# Altium schematic sheet DM0255_Power.SchDoc: =project_title
size Tabloid; PageSetup: Record=PageOptions|CenterHorizontal=True|CenterVertical=True|PrintScale=0.73|XCorrection=1.00|YCorrection=1.00|PrintKind=0|BorderSize=5000000|LeftOffset=0|BottomOffset=0|Orientation=2|PaperLength=1000|PaperWidth=1000|Scale=100|PaperSource=7|PrintQuality=-4|MediaType=1|DitherType=10|PaperKind=A4|PrintScaleMode=1; CompanyName: Luxonis Holding; Organization: Luxonis Holding; Address1: 1925 Harmony Park Drive; Address2: Westminster, CO; Address3: 80234; Address4: United States; SheetNumber: 2; SheetTotal: 3
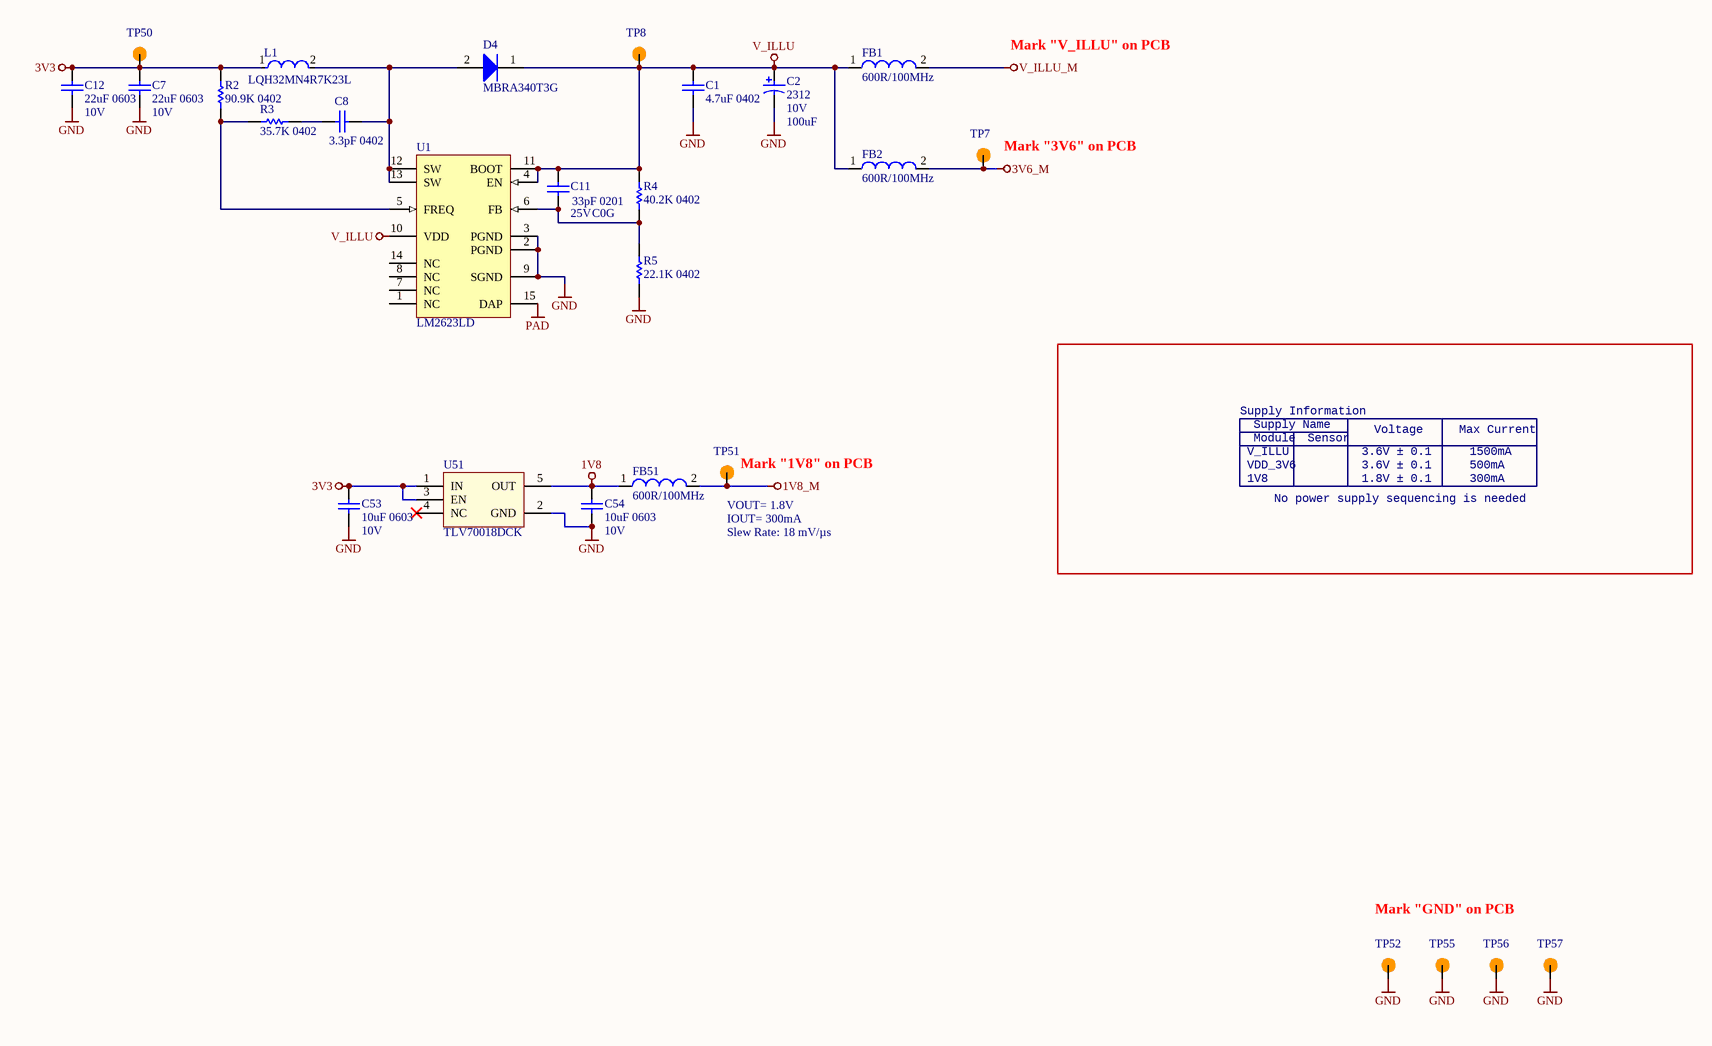
[diagram p0: DM0255_Power.SchDoc]

## Parts
C1  4.7uF 0402  [CAPC0402(1005)70_N]
C2  Size Code: 2312  Rated DC Voltage (URdc): 10V  Capacitance: 100uF  [AVX-TAJ-C-2_L]  (hidden comment: TAJC107K010RNJ)
C7  22uF 0603  Voltage Rating: 10V  [CAPC0603(1608)100_N]
C8  3.3pF 0402  [CAPC0402(1005)60_L]
C11  33pF 0201  Voltage Rating: 25V  Dielectric: C0G  [CAPC0201(0603)33_L]
C12  22uF 0603  Voltage Rating: 10V  [CAPC0603(1608)100_N]
C53  10uF 0603  Voltage Rating: 10V  [CAPC0603(1608)100_N]
C54  10uF 0603  Voltage Rating: 10V  [CAPC0603(1608)100_N]
D4  MBRA340T3G  [ONSC-SMA-2-403D-02_F_V]
FB1  600R/100MHz  [2508056017Y2]
FB2  600R/100MHz  [2508056017Y2]
FB51  600R/100MHz  [2508056017Y2]
L1  LQH32MN4R7K23L  [FP-LQH32CH_23-MFG]
R2  90.9K 0402  [RESC0402(1005)_L]
R3  35.7K 0402  [RESC0402(1005)_L]
R4  40.2K 0402  [RESC0402(1005)_L]
R5  22.1K 0402  [RESC0402(1005)_N]
TP7  TP100_150_NS  [TP100_150_NS]  (value not drawn)  (no BOM)
TP8  TP100_150_NS  [TP100_150_NS]  (value not drawn)  (no BOM)
TP50  TP100_150_NS  [TP100_150_NS]  (value not drawn)  (no BOM)
TP51  TP100_150_NS  [TP100_150_NS]  (value not drawn)  (no BOM)
TP52  TP100_150_NS  [TP100_150_NS]  (value not drawn)  (no BOM)
TP55  TP100_150_NS  [TP100_150_NS]  (value not drawn)  (no BOM)
TP56  TP100_150_NS  [TP100_150_NS]  (value not drawn)  (no BOM)
TP57  TP100_150_NS  [TP100_150_NS]  (value not drawn)  (no BOM)
U1  LM2623LD  [LDA14A]
U51  TLV70018DCK  [TLV70018DCK]

## Nets
1V8: C54.2 FB51.1 U51.5(OUT)
1V8_M: FB51.2 TP51.1
3V3: C7.2 C12.2 C53.2 L1.1 R2.2 TP50.1 U51.1(IN) U51.3(EN)
3V6_M: FB2.2 TP7.1
GND: C1.1 C2.2 C7.1 C12.1 C53.1 C54.1 R5.1 TP52.1 TP55.1 TP56.1 TP57.1 U1.2(PGND) U1.3(PGND) U1.9(SGND) U51.2(GND)
PAD: U1.15(DAP)
V_ILLU: C1.2 C2.1 C11.2 D4.1(K) FB1.1 FB2.1 R4.2 TP8.1 U1.4(EN) U1.10(VDD) U1.11(BOOT)
V_ILLU_M: FB1.2
NetC8_1: C8.1 R3.2
NetC8_2: C8.2 D4.2(A) L1.2 U1.12(SW) U1.13(SW)
NetC11_1: C11.1 R4.1 R5.2 U1.6(FB)
NetR2_1: R2.1 R3.1 U1.5(FREQ)

Not connected (* = marked no-connect by the designer): U1 1(NC) 7(NC) 8(NC) 14(NC); U51 4(NC)*

## Notes on the sheet
- Mark "V_ILLU" on PCB
- (near TP7) Mark "3V6" on PCB
- Supply Information
- Supply Name
- Voltage
- Max Current
- VOUT= 1.8V
- (near TP51) Mark "1V8" on PCB
- V_ILLU
- VDD_3V6
- 1V8
- Module
- No power supply sequencing is needed
- Sensor
- 3.6V ± 0.1
- 1.8V ± 0.1
- 1500mA
- 500mA
- 300mA
- IOUT= 300mA
- Slew Rate: 18 mV/µs
- Mark "GND" on PCB
- Title
- Size:
- Date:
- Tabloid
- Number:
- Time:
- Revision:
- Sheet
- of
- Drawn by:

## Library data of the parts
C1 = GRM155R60J475ME87D: CAP CER 4.7UF 6.3V X5R 0402; Manufacturer 1: Murata; Tolerance: 20%; Supplier 1: Digi-Key; Manufacturer Part Number 1: GRM155R60J475ME87D; RoHS: Yes; Category: Ceramic Capacitors; Stock 1: 207854; Pricing 1: 1=0,14000, 10=0,10100, 50=0,05720, 100=0,04740, 500=0,03322, 1000=0,02750, 2500=0,02559, 5000=0,02341 (USD); Mount: Surface Mount; Case/Package: 0402; Case Code (Metric): 1005; Case Code (Imperial): 0402; Min Operating Temperature: -55°C; Max Operating Temperature: 85°C; Capacitance: 4.7uF; Dielectric: X5R; Package Quantity: 1; Voltage Rating: 6.3V; Packaging: Tape and Reel; Voltage: 6.3V; Voltage Rating (DC): 6.3V; Series: GRM; Construction: Flat; Length: 1mm; Width: 0.02inch; Height: 0.5mm; Thickness: 0.022inch; Depth: 0.5mm; Radiation Hardening: No; REACH SVHC: No SVHC; Lead Free: Lead Free; RoHS Compliant: Yes; ComponentLink1URL: https://datasheet.ciiva.com/3779/21116grm155r60j475me8723-3779229.pdf?src-supplier=Arrow+Electronics; ComponentLink1Description: https://datasheet.ciiva.com/3779/21116grm155r60j475me8723-3779229.pdf?src-supplier=Arrow+Electronics; ComponentLink2URL: https://datasheet.ciiva.com/136/partnumbering-e-01-136783.pdf?src-supplier=Digi-Key; ComponentLink2Description: https://datasheet.ciiva.com/136/partnumbering-e-01-136783.pdf?src-supplier=Digi-Key; ComponentLink3URL: https://datasheet.ciiva.com/136/partnumbering-e-01-136784.pdf?src-supplier=Digi-Key; ComponentLink3Description: https://datasheet.ciiva.com/136/partnumbering-e-01-136784.pdf?src-supplier=Digi-Key; Supplier Part Number 1: 490-5408-1-ND
C2 = TAJC107K010RNJ: Tantalum Capacitor, Polarized, Tantalum (dry/solid), 10V, 10% +Tol, 10% -Tol, 100uF, Surface Mount, 2312; Manufacturer 1: Kyocera AVX; ESR (Equivalent Series Resistance): 1.2R; Leakage Current: 10uA; Tan Delta: 0.08; Reference Standard: CECC30801-005; Supplier 1: Digi-Key; Manufacturer Part Number 1: TAJC107K010RNJ; RoHS: Yes; Category: Tantalum Capacitors; Stock 1: 2500; Pricing 1: 1=0,67000, 10=0,47300, 50=0,35780, 100=0,31160 (USD); Mount: Surface Mount; Number of Pins: 2; Dielectric Material: Tantalum; Package Shape: Rectangular; Terminal Finish: Nickel; Min Operating Temperature: -55°C; Max Operating Temperature: 125°C; JESD-609 Code: e3; Polarity: Polarized; Capacitor Type: Tantalum; Negative Tolerance: 10%; Package Style: SMTMeter; Packaging: Tape and Reel; Positive Tolerance: 10%; Termination: J BEND; Length: 6mm; Width: 3.2mm; Height: 2.6mm; REACH SVHC: Yes; RoHS Compliant: Yes; ComponentLink1URL: https://datasheet.ciiva.com:443/pdfs/VipMasterIC/IC/AVXC/AVXC-S-A0008794508/AVXC-S-A0008794508-1.pdf?src-supplier=IHS+Markit; ComponentLink1Description: https://datasheet.ciiva.com:443/pdfs/VipMasterIC/IC/AVXC/AVXC-S-A0008794508/AVXC-S-A0008794508-1.pdf?src-supplier=IHS+Markit; ComponentLink2URL: https://datasheet.ciiva.com/6186/13070-6186737.pdf?src-supplier=Farnell; ComponentLink2Description: https://datasheet.ciiva.com/6186/13070-6186737.pdf?src-supplier=Farnell; ComponentLink3URL: https://datasheet.ciiva.com/11793/0900766b80ccdc61-11793710.pdf?src-supplier=RSComponents; ComponentLink3Description: https://datasheet.ciiva.com/11793/0900766b80ccdc61-11793710.pdf?src-supplier=RSComponents; ComponentLink4URL: https://datasheet.ciiva.com/26341/559445-da-01-en-tacc-c-6-0-mm-x-3-2-mm-x-2-6-mm-100-uf-26341786.pdf?src-supplier=Conrad; ComponentLink4Description: https://datasheet.ciiva.com/26341/559445-da-01-en-tacc-c-6-0-mm-x-3-2-mm-x-2-6-mm-100-uf-26341786.pdf?src-supplier=Conrad; ComponentLink5URL: https://datasheet.ciiva.com/7720/taj-7720616.pdf?src-supplier=Element14; ComponentLink5Description: https://datasheet.ciiva.com/7720/taj-7720616.pdf?src-supplier=Element14; ComponentLink6URL: https://datasheet.ciiva.com/14608/70001050-14608635.pdf?src-supplier=Allied+Electronics; ComponentLink6Description: https://datasheet.ciiva.com/14608/70001050-14608635.pdf?src-supplier=Allied+Electronics; ComponentLink7URL: https://datasheet.ciiva.com/7720/taj-7720618.pdf?src-supplier=Element14; ComponentLink7Description: https://datasheet.ciiva.com/7720/taj-7720618.pdf?src-supplier=Element14; ComponentLink8URL: https://datasheet.ciiva.com/18710/taj-eng-18710871.pdf?src-supplier=Distrelec; ComponentLink8Description: https://datasheet.ciiva.com/18710/taj-eng-18710871.pdf?src-supplier=Distrelec; ComponentLink9URL: https://datasheet.ciiva.com/3004/taj-3004482.pdf?src-supplier=Avnet; ComponentLink9Description: https://datasheet.ciiva.com/3004/taj-3004482.pdf?src-supplier=Avnet; ComponentLink10URL: https://datasheet.ciiva.com/16486/taj-16486014.pdf?src-supplier=Avnet+Asia; ComponentLink10Description: https://datasheet.ciiva.com/16486/taj-16486014.pdf?src-supplier=Avnet+Asia; ComponentLink11URL: https://datasheet.ciiva.com/264/taj-264316.pdf?src-supplier=Digi-Key; ComponentLink11Description: https://datasheet.ciiva.com/264/taj-264316.pdf?src-supplier=Digi-Key; ComponentLink12URL: https://datasheet.ciiva.com/15163/getdatasheetpartid-87208-15163226.pdf?src-supplier=Verical; ComponentLink12Description: https://datasheet.ciiva.com/15163/getdatasheetpartid-87208-15163226.pdf?src-supplier=Verical; ComponentLink13URL: https://datasheet.ciiva.com/7720/13070-7720615.pdf?src-supplier=Element14; ComponentLink13Description: https://datasheet.ciiva.com/7720/13070-7720615.pdf?src-supplier=Element14; ComponentLink14URL: https://datasheet.ciiva.com/14590/70001050-14590206.pdf?src-supplier=Allied+Electronics; ComponentLink14Description: https://datasheet.ciiva.com/14590/70001050-14590206.pdf?src-supplier=Allied+Electronics; ComponentLink15URL: https://datasheet.ciiva.com/11226/taj-11226030.pdf?src-supplier=Avnet; ComponentLink15Description: https://datasheet.ciiva.com/11226/taj-11226030.pdf?src-supplier=Avnet; ComponentLink16URL: https://datasheet.ciiva.com/264/taj-264317.pdf?src-supplier=Digi-Key; ComponentLink16Description: https://datasheet.ciiva.com/264/taj-264317.pdf?src-supplier=Digi-Key; ComponentLink17URL: https://datasheet.ciiva.com/16350/taj-16350362.pdf?src-supplier=Future+Electronics; ComponentLink17Description: https://datasheet.ciiva.com/16350/taj-16350362.pdf?src-supplier=Future+Electronics; ComponentLink18URL: https://datasheet.ciiva.com/7720/1680476-7720617.pdf?src-supplier=Element14; ComponentLink18Description: https://datasheet.ciiva.com/7720/1680476-7720617.pdf?src-supplier=Element14; ComponentLink19URL: https://datasheet.ciiva.com/264/taj-264318.pdf?src-supplier=Digi-Key; ComponentLink19Description: https://datasheet.ciiva.com/264/taj-264318.pdf?src-supplier=Digi-Key; ComponentLink20URL: https://datasheet.ciiva.com/7720/taj-7720830.pdf?src-supplier=Element14; ComponentLink20Description: https://datasheet.ciiva.com/7720/taj-7720830.pdf?src-supplier=Element14; Supplier Part Number 1: 478-1704-1-ND
C7 C12 = GRM188R61A226ME15D: CAP CER 22UF 10V X5R 0603 20%; Manufacturer 1: Murata; Material: Ceramic; ComponentLink1URL: https://datasheet.ciiva.com/46444/1769893-46444975.pdf?src-supplier=Element14; ComponentLink1Description: https://datasheet.ciiva.com/46444/1769893-46444975.pdf?src-supplier=Element14; Supplier 1: Digi-Key; Manufacturer Part Number 1: GRM188R61A226ME15D; Stock 1: 984716; Pricing 1: 1=0.31000, 10=0.21500, 100=0.12160, 500=0.08584, 1000=0.07512 (USD); RoHS: Yes; Mount: Surface Mount; Case/Package: 0603; Weight: 0.000222oz; Case Code (Metric): 1608; Case Code (Imperial): 0603; Min Operating Temperature: -55°C; Max Operating Temperature: 85°C; Capacitance: 22uF; Tolerance: 20%; Packaging: Tape and Reel; Dielectric: X5R; Voltage Rating (DC): 10V; Termination: SMD/SMT; Package Quantity: 4000; Length: 1.6mm; Height: 0.8mm; Width: 0.8mm; Thickness: 0.039inch; Depth: 0.8mm; REACH SVHC: No SVHC; Lead Free: Lead Free; Supplier Part Number 1: 490-10476-1-ND
C8 = GRM1555C1H3R3BA01D: Ceramic Capacitor, Multilayer, Ceramic, 50V, 3.03% +Tol, 3.03% -Tol, C0G, 30ppm/Cel TC, 0.0000033uF, Surface Mount, 0402; Manufacturer 1: Murata; Multilayer: Yes; Supplier 1: Digi-Key; Manufacturer Part Number 1: GRM1555C1H3R3BA01D; RoHS: Yes; Category: Ceramic Capacitors; Stock 1: 102081; Pricing 1: 1=0,10000, 10=0,05300, 50=0,02900, 100=0,02370, 500=0,01694, 1000=0,01331, 2500=0,01210, 5000=0,01113 (USD); Mount: Surface Mount; Number of Pins: 2; Dielectric Material: Ceramic; Package Shape: Rectangular; Size Code: 0402; Terminal Finish: Nickel; Min Operating Temperature: -55°C; Max Operating Temperature: 125°C; JESD-609 Code: e3; Capacitance: 3.3pF; Capacitor Type: Ceramic; Negative Tolerance: 3.03%; Package Style: SMTMeter; Packaging: Tape and Reel; Positive Tolerance: 3.03%; Rated DC Voltage (URdc): 50V; Temperature Characteristics Code: C0G; Termination: Wraparound; Length: 1mm; Width: 0.5mm; Height: 0.5mm; REACH SVHC: Yes; RoHS Compliant: Yes; ComponentLink1URL: https://datasheet.ciiva.com:443/pdfs/VipMasterIC/IC/MURE/MURE-S-A0004347008/MURE-S-A0004347329-1.pdf?src-supplier=IHS+Markit; ComponentLink1Description: https://datasheet.ciiva.com:443/pdfs/VipMasterIC/IC/MURE/MURE-S-A0004347008/MURE-S-A0004347329-1.pdf?src-supplier=IHS+Markit; ComponentLink2URL: https://datasheet.ciiva.com/11614/product-11614449.pdf?src-supplier=Avnet; ComponentLink2Description: https://datasheet.ciiva.com/11614/product-11614449.pdf?src-supplier=Avnet; ComponentLink3URL: https://datasheet.ciiva.com/6270/grm1555c1h3r0wa01-01-6270835.pdf?src-supplier=Digi-Key; ComponentLink3Description: https://datasheet.ciiva.com/6270/grm1555c1h3r0wa01-01-6270835.pdf?src-supplier=Digi-Key; ComponentLink4URL: https://datasheet.ciiva.com/18184/getdatasheetpartid-318269-18184366.pdf?src-supplier=Verical; ComponentLink4Description: https://datasheet.ciiva.com/18184/getdatasheetpartid-318269-18184366.pdf?src-supplier=Verical; ComponentLink5URL: https://datasheet.ciiva.com/3779/grm1555c1h3r3ba0123-3779149.pdf?src-supplier=Arrow+Electronics; ComponentLink5Description: https://datasheet.ciiva.com/3779/grm1555c1h3r3ba0123-3779149.pdf?src-supplier=Arrow+Electronics; ComponentLink6URL: https://datasheet.ciiva.com/6270/partnumbering-e-01-6270839.pdf?src-supplier=Digi-Key; ComponentLink6Description: https://datasheet.ciiva.com/6270/partnumbering-e-01-6270839.pdf?src-supplier=Digi-Key; ComponentLink7URL: https://datasheet.ciiva.com/6270/partnumbering-e-01-6270837.pdf?src-supplier=Digi-Key; ComponentLink7Description: https://datasheet.ciiva.com/6270/partnumbering-e-01-6270837.pdf?src-supplier=Digi-Key; Supplier Part Number 1: 490-6238-1-ND
C11 = GRM0335C1E330JA01D: CAP CER 33PF 25V C0G/NP0 0201; Manufacturer 1: Murata; Tolerance: 5%; Supplier 1: Digi-Key; Manufacturer Part Number 1: GRM0335C1E330JA01D; Stock 1: 1107200; Pricing 1: 1=0.10000, 10=0.01500, 100=0.00680, 500=0.00484, 1000=0.00380, 2500=0.00345, 5000=0.00317 (USD); RoHS: Yes; Mount: Surface Mount; Case/Package: 0201; Case Code (Metric): 0603; Case Code (Imperial): 0201; Min Operating Temperature: -55°C; Max Operating Temperature: 125°C; Capacitance: 33pF; Packaging: Tape and Reel; Package Quantity: 15000; Voltage Rating (DC): 25V; Termination: SMD/SMT; Length: 0.6mm; Height: 0.3mm; Width: 0.012inch; Thickness: 0.013inch; Depth: 0.3mm; REACH SVHC: No SVHC; Lead Free: Lead Free; ComponentLink1URL: https://datasheet.ciiva.com/29538/partnumbering-e-01-29538933.pdf?src-supplier=Digi-Key; ComponentLink1Description: https://datasheet.ciiva.com/29538/partnumbering-e-01-29538933.pdf?src-supplier=Digi-Key; Supplier 2: Mouser; Supplier Part Number 2: 81-GRM0335C1E330JA1D; Supplier Part Number 1: 490-10678-1-ND
C53 C54 = GRM188R61A106ME69D: CAP CER 10UF 10V X5R 0603 20%; Manufacturer 1: Murata; Material: Ceramic; Supplier 1: Digi-Key; Manufacturer Part Number 1: GRM188R61A106ME69D; Stock 1: 2873098; Pricing 1: 1=0.21000, 10=0.14100, 100=0.07130, 500=0.04876, 1000=0.04313 (USD); RoHS: Yes; Mount: Surface Mount; Case/Package: 0603; Weight: 0.000222oz; Case Code (Metric): 1608; Case Code (Imperial): 0603; Min Operating Temperature: -55°C; Max Operating Temperature: 85°C; Packaging: Tape and Reel; Tolerance: 20%; Capacitance: 10uF; Dielectric: X5R; Voltage Rating (DC): 10V; Package Quantity: 4000; Termination: SMD/SMT; Length: 1.6mm; Height: 0.8mm; Width: 0.8mm; Thickness: 0.035inch; Depth: 0.8mm; REACH SVHC: Unknown; Lead Free: Lead Free; ComponentLink1URL: http://www.mouser.com/ds/2/281/c02e-2905.pdf?src-supplier=Mouser; ComponentLink1Description: http://www.mouser.com/ds/2/281/c02e-2905.pdf?src-supplier=Mouser; ComponentLink2URL: http://components.arrow.com/part/dataview/0323_06119472?src-supplier=Arrow+Europe; ComponentLink2Description: http://components.arrow.com/part/dataview/0323_06119472?src-supplier=Arrow+Europe; ComponentLink3URL: http://www.farnell.com/datasheets/2048014.pdf?src-supplier=Farnell; ComponentLink3Description: http://www.farnell.com/datasheets/2048014.pdf?src-supplier=Farnell; ComponentLink4URL: http://www.farnell.com/datasheets/1872210.pdf?src-supplier=Farnell; ComponentLink4Description: http://www.farnell.com/datasheets/1872210.pdf?src-supplier=Farnell; ComponentLink5URL: http://search.murata.co.jp/Ceramy/image/img/A01X/G101/ENG/GRM188R61A106ME69-01.pdf?src-supplier=Digi-Key; ComponentLink5Description: http://search.murata.co.jp/Ceramy/image/img/A01X/G101/ENG/GRM188R61A106ME69-01.pdf?src-supplier=Digi-Key; ComponentLink6URL: http://www.farnell.com/datasheets/1872210.pdf?src-supplier=Newark; ComponentLink6Description: http://www.farnell.com/datasheets/1872210.pdf?src-supplier=Newark; ComponentLink7URL: http://www.farnell.com/datasheets/2048014.pdf?src-supplier=Element14; ComponentLink7Description: http://www.farnell.com/datasheets/2048014.pdf?src-supplier=Element14; ComponentLink8URL: http://www.farnell.com/datasheets/2048014.pdf?src-supplier=Newark; ComponentLink8Description: http://www.farnell.com/datasheets/2048014.pdf?src-supplier=Newark; Supplier Part Number 1: 490-10475-1-ND
D4 = MBRA340T3G: Schottky Power Rectifier, 2-Pin SMA, Pb-Free, Tape and Reel; Manufacturer 1: On Semiconductor; IFSM Max (A): 100; Configuration: Single; PackageVersion: Rev. F, 11/2008; ComponentLink1URL: http://www.onsemi.com/; Packing: Tape and Reel; PackageReference: SMA-2-403D-02_F; DatasheetVersion: Rev. 6; ComponentLink3URL: http://www.onsemi.com/pub_link/Collateral/1SMA5913BT3-D.PDF; ComponentLink2Description: Datasheet; PackageDescription: 2-Pin Small Molded Package, J-Bend Lead, Body 2.605 x 4.315 mm; ComponentLink3Description: Package Specification; Manufacturer Part Number 1: MBRA340T3G; RoHS: TRUE; ComponentLink1Description: Manufacturer URL; ComponentLink2URL: http://www.onsemi.cn/pub_link/Collateral/MBRA340T3-D.PDF; Mounting Technology: Surface Mount
FB1 FB2 FB51 = 2508056017Y2: FERRITE BEAD, 0.1OHM, 2A, 0805, 600R/100MHz; Manufacturer 1: Fair-Rite; Impedance: 600R; Tolerance: 25%; Resistance: 350mR; DC Resistance (DCR): 100mR; Test Frequency: 100MHz; Supplier 1: Digi-Key; Manufacturer Part Number 1: 2508056017Y2; Stock 1: 100491; Pricing 1: 1=0.10000, 10=0.07900, 25=0.07120, 50=0.05240, 100=0.04520, 250=0.03568, 500=0.03014, 1000=0.02538 (USD); RoHS: Yes; Case/Package: 0805; Number of Pins: 2; Case Code (Metric): 2012; Case Code (Imperial): 0805; Min Operating Temperature: -55°C; Max Operating Temperature: 125°C; Package Quantity: 4000; Packaging: Tape and Reel; Max DC Current: 2A; Termination: SMD/SMT; Military Standard: Not; DC Current: 2A; Current Rating: 2A; Frequency: 100MHz; Length: 2mm; Height: 0.9mm; Width: 1.25mm; Depth: 1.25mm; Radiation Hardening: No; REACH SVHC: No SVHC; ComponentLink1URL: https://datasheet.ciiva.com/3854/3802508056017y2-3854245.pdf?src-supplier=Arrow; ComponentLink1Description: https://datasheet.ciiva.com/3854/3802508056017y2-3854245.pdf?src-supplier=Arrow; ComponentLink2URL: https://datasheet.ciiva.com/22735/652149-22735047.pdf?src-supplier=Element14; ComponentLink2Description: https://datasheet.ciiva.com/22735/652149-22735047.pdf?src-supplier=Element14; ComponentLink3URL: https://datasheet.ciiva.com/1127/26143-1127514.pdf?src-supplier=Farnell; ComponentLink3Description: https://datasheet.ciiva.com/1127/26143-1127514.pdf?src-supplier=Farnell; ComponentLink4URL: https://datasheet.ciiva.com/18090/getdatasheetpartid-212640-18090187.pdf?src-supplier=Verical; ComponentLink4Description: https://datasheet.ciiva.com/18090/getdatasheetpartid-212640-18090187.pdf?src-supplier=Verical; ComponentLink5URL: https://datasheet.ciiva.com/7620/26143-7620140.pdf?src-supplier=Element14; ComponentLink5Description: https://datasheet.ciiva.com/7620/26143-7620140.pdf?src-supplier=Element14; Supplier Part Number 1: 1934-1487-1-ND
L1 = LQH32MN4R7K23L: Wire Wound Ferrite Inductor for General Circuits 4.7μH ±10% 1.2Ω 270mA 1210; Manufacturer 1: Murata; Series Resistance: 1.2R; Test Frequency: 1MHz; Frequency: 31MHz; Shielding: Unshielded; Inductance: 4.7uH; Q Factor: 20; Case/Package: 1210; Min Operating Temperature: -25°C; Case Code (Metric): 3225; Height - Seated (Max): 0.087inch; Max DC Current: 270mA; Current Rating: 270mA; Case Code (Imperial): 1210; Tolerance: 10%; Length: 3.2mm; Width: 2.5mm; Number of Pins: 2; Weight: 0.000564oz; Packaging: Tape and Reel; Core Material: Ferrite; Height: 2mm; Termination: SMD/SMT; Self Resonant Frequency: 31MHz; DC Current: 270mA; Max Operating Temperature: 85°C; Radiation Hardening: No; Lead Free: Lead Free; Inductor Type: Wirewound; Rated Current-Max: 270mA; Mount: Surface Mount; Inductance Tolerance: 10%; Resistor Type: Wirewound; Military Standard: Not; Package Quantity: 1; REACH SVHC: No SVHC; Series: LQH32M; Depth: 2.7mm; DC Resistance (DCR): 1.2R; Manufacturer Part Number 1: LQH32MN4R7K23L
R2 = CRCW040290K9FKED: Fixed Resistor, Metal Glaze/thick Film, 0.063W, 90900ohm, 50V, 1% +/-Tol, 100ppm/Cel, Surface Mount, 0402; Manufacturer 1: Vishay; Rated Power Dissipation (P): 63mW; Resistance: 90.9kR; Temperature Coefficient: 100ppm/°C; Rated Temperature: 70°C; Package Height: 0.35mm; Package Length: 1mm; Package Width: 0.5mm; Reference Standard: AEC-Q200; Supplier 1: RSComponents; Manufacturer Part Number 1: CRCW040290K9FKED; RoHS: Yes; Category: Chip SMD Resistors; Stock 1: 1; Pricing 1: 50=0,05200, 250=0,04800, 500=0,04500, 1000=0,04300, 2500=0,03900 (USD); Mount: Surface Mount; Number of Pins: 2; Size Code: 0402; Terminal Finish: Nickel; Package Shape: Rectangular; Min Operating Temperature: -55°C; Max Operating Temperature: 155°C; Tolerance: 1%; JESD-609 Code: e3; Resistor Type: FIXED RESISTOR; Construction: Chip; Package Style: SMTMeter; Packaging: Tape and Reel; Technology: METAL GLAZE/THICK FILM; Working Voltage: 50V; Termination: Wraparound; REACH SVHC: Yes; RoHS Compliant: Yes; ComponentLink1URL: https://datasheet.ciiva.com:443/pdfs/VipMasterIC/IC/VISH/VISH-S-A0007266705/VISH-S-A0007266705-1.pdf?src-supplier=IHS+Markit; ComponentLink1Description: https://datasheet.ciiva.com:443/pdfs/VipMasterIC/IC/VISH/VISH-S-A0007266705/VISH-S-A0007266705-1.pdf?src-supplier=IHS+Markit; ComponentLink2URL: https://datasheet.ciiva.com/11809/0900766b80d98824-11809982.pdf?src-supplier=RSComponents; ComponentLink2Description: https://datasheet.ciiva.com/11809/0900766b80d98824-11809982.pdf?src-supplier=RSComponents; ComponentLink3URL: https://datasheet.ciiva.com/2463/dcrcwe3-2463792.pdf?src-supplier=Digi-Key; ComponentLink3Description: https://datasheet.ciiva.com/2463/dcrcwe3-2463792.pdf?src-supplier=Digi-Key; ComponentLink4URL: https://datasheet.ciiva.com/16763/70201119-16763494.pdf?src-supplier=Allied+Electronics; ComponentLink4Description: https://datasheet.ciiva.com/16763/70201119-16763494.pdf?src-supplier=Allied+Electronics; ComponentLink5URL: https://datasheet.ciiva.com/5919/1697337-5919063.pdf?src-supplier=Farnell; ComponentLink5Description: https://datasheet.ciiva.com/5919/1697337-5919063.pdf?src-supplier=Farnell; ComponentLink6URL: https://datasheet.ciiva.com/7816/1697337-7816027.pdf?src-supplier=Element14; ComponentLink6Description: https://datasheet.ciiva.com/7816/1697337-7816027.pdf?src-supplier=Element14; ComponentLink7URL: https://datasheet.ciiva.com/7743/125364-7743772.pdf?src-supplier=Element14; ComponentLink7Description: https://datasheet.ciiva.com/7743/125364-7743772.pdf?src-supplier=Element14; ComponentLink8URL: https://datasheet.ciiva.com/7816/1697337-7816028.pdf?src-supplier=Element14; ComponentLink8Description: https://datasheet.ciiva.com/7816/1697337-7816028.pdf?src-supplier=Element14; ComponentLink9URL: https://datasheet.ciiva.com/2463/dcrcwe3-2463790.pdf?src-supplier=Digi-Key; ComponentLink9Description: https://datasheet.ciiva.com/2463/dcrcwe3-2463790.pdf?src-supplier=Digi-Key; ComponentLink10URL: https://datasheet.ciiva.com/5548/dcrcwe3-109170-5548606.pdf?src-supplier=Mouser; ComponentLink10Description: https://datasheet.ciiva.com/5548/dcrcwe3-109170-5548606.pdf?src-supplier=Mouser; ComponentLink11URL: https://datasheet.ciiva.com/2463/dcrcwe3-2463791.pdf?src-supplier=Digi-Key; ComponentLink11Description: https://datasheet.ciiva.com/2463/dcrcwe3-2463791.pdf?src-supplier=Digi-Key; ComponentLink12URL: https://datasheet.ciiva.com/3256/dcrcwe3-3256879.pdf?src-supplier=Avnet; ComponentLink12Description: https://datasheet.ciiva.com/3256/dcrcwe3-3256879.pdf?src-supplier=Avnet; Supplier Part Number 1: 6789639
R3 = CRCW040235K7FKED: Fixed Resistor, Metal Glaze/thick Film, 0.063W, 35700ohm, 50V, 1% +/-Tol, 100ppm/Cel, Surface Mount, 0402; Manufacturer 1: Vishay; Rated Power Dissipation (P): 63mW; Rated Temperature: 70°C; Resistance: 35.7kR; Temperature Coefficient: 100ppm/°C; Package Height: 0.35mm; Package Length: 1mm; Package Width: 0.5mm; Reference Standard: AEC-Q200; Supplier 1: Digi-Key; Manufacturer Part Number 1: CRCW040235K7FKED; RoHS: Yes; Category: Chip SMD Resistors; Stock 1: 8444; Pricing 1: 1=0,10000, 10=0,03800, 100=0,01530, 1000=0,00686, 2500=0,00595, 5000=0,00492 (USD); Mount: Surface Mount; Number of Pins: 2; Package Shape: Rectangular; Size Code: 0402; Terminal Finish: Nickel; Min Operating Temperature: -55°C; Max Operating Temperature: 155°C; Tolerance: 1%; JESD-609 Code: e3; Resistor Type: FIXED RESISTOR; Construction: Chip; Package Style: SMTMeter; Packaging: Tape and Reel; Technology: METAL GLAZE/THICK FILM; Termination: Wraparound; Working Voltage: 50V; REACH SVHC: Yes; RoHS Compliant: Yes; ComponentLink1URL: https://datasheet.ciiva.com:443/pdfs/VipMasterIC/IC/VISH/VISH-S-A0007266705/VISH-S-A0007266705-1.pdf?src-supplier=IHS+Markit; ComponentLink1Description: https://datasheet.ciiva.com:443/pdfs/VipMasterIC/IC/VISH/VISH-S-A0007266705/VISH-S-A0007266705-1.pdf?src-supplier=IHS+Markit; ComponentLink2URL: https://datasheet.ciiva.com/2495/dcrcwe3-2495171.pdf?src-supplier=Digi-Key; ComponentLink2Description: https://datasheet.ciiva.com/2495/dcrcwe3-2495171.pdf?src-supplier=Digi-Key; ComponentLink3URL: https://datasheet.ciiva.com/2495/dcrcwe3-2495172.pdf?src-supplier=Digi-Key; ComponentLink3Description: https://datasheet.ciiva.com/2495/dcrcwe3-2495172.pdf?src-supplier=Digi-Key; ComponentLink4URL: https://datasheet.ciiva.com/22705/1697337-22705820.pdf?src-supplier=Element14; ComponentLink4Description: https://datasheet.ciiva.com/22705/1697337-22705820.pdf?src-supplier=Element14; ComponentLink5URL: https://datasheet.ciiva.com/2495/dcrcwe3-2495170.pdf?src-supplier=Digi-Key; ComponentLink5Description: https://datasheet.ciiva.com/2495/dcrcwe3-2495170.pdf?src-supplier=Digi-Key; ComponentLink6URL: https://datasheet.ciiva.com/7743/125364-7743609.pdf?src-supplier=Element14; ComponentLink6Description: https://datasheet.ciiva.com/7743/125364-7743609.pdf?src-supplier=Element14; ComponentLink7URL: https://datasheet.ciiva.com/5545/dcrcwe3-109170-5545132.pdf?src-supplier=Mouser; ComponentLink7Description: https://datasheet.ciiva.com/5545/dcrcwe3-109170-5545132.pdf?src-supplier=Mouser; ComponentLink8URL: https://datasheet.ciiva.com/22869/70201119-22869919.pdf?src-supplier=Allied+Electronics; ComponentLink8Description: https://datasheet.ciiva.com/22869/70201119-22869919.pdf?src-supplier=Allied+Electronics; Supplier Part Number 1: 541-35.7KLCT-ND
R4 = RC0402FR-0740K2L: RES SMD 40.2K OHM 1% 1/16W 0402; Manufacturer 1: Yageo; Resistance: 40.2kR; Temperature Coefficient: 100ppm/°C; Power Rating: 62.5mW; Voltage Rating: 50V; Max Power Dissipation: 63mW; Supplier 1: Digi-Key; Manufacturer Part Number 1: RC0402FR-0740K2L; Stock 1: 1379708; Pricing 1: 1=0.10000, 10=0.01600, 100=0.00640, 1000=0.00289, 2500=0.00251, 5000=0.00207 (USD); RoHS: Yes; Case/Package: 0402; Case Code (Metric): 1005; Case Code (Imperial): 0402; Contact Plating: Tin,Matte; Min Operating Temperature: -55°C; Max Operating Temperature: 155°C; Tolerance: 1%; Packaging: Tape and Reel; Composition: Thick Film; Package Quantity: 1; Number of Terminations: 2; Termination: SMD/SMT; Voltage Rating (DC): 50V; Features: Moisture Resistant; Military Standard: Not; Length: 0.039inch; Height: 0.016inch; Width: 0.02inch; Depth: 0.5mm; Lead Free: Lead Free; ComponentLink1URL: https://datasheet.ciiva.com/2453/pyu-r-int-thick-7-2453437.pdf?src-supplier=Digi-Key; ComponentLink1Description: https://datasheet.ciiva.com/2453/pyu-r-int-thick-7-2453437.pdf?src-supplier=Digi-Key; ComponentLink2URL: https://datasheet.ciiva.com/2453/pyu-r-int-thick-7-2453438.pdf?src-supplier=Digi-Key; ComponentLink2Description: https://datasheet.ciiva.com/2453/pyu-r-int-thick-7-2453438.pdf?src-supplier=Digi-Key; ComponentLink3URL: https://datasheet.ciiva.com/8889/pyu-rc0402-51-rohs-l-6-8889263.pdf?src-supplier=Avnet; ComponentLink3Description: https://datasheet.ciiva.com/8889/pyu-rc0402-51-rohs-l-6-8889263.pdf?src-supplier=Avnet; ComponentLink4URL: https://datasheet.ciiva.com/28400/pyu-rc0402-51-rohs-l-6-28400199.pdf?src-supplier=Avnet+Europe; ComponentLink4Description: https://datasheet.ciiva.com/28400/pyu-rc0402-51-rohs-l-6-28400199.pdf?src-supplier=Avnet+Europe; ComponentLink5URL: https://datasheet.ciiva.com/2453/pyu-r-int-thick-7-2453436.pdf?src-supplier=Digi-Key; ComponentLink5Description: https://datasheet.ciiva.com/2453/pyu-r-int-thick-7-2453436.pdf?src-supplier=Digi-Key; ComponentLink6URL: https://datasheet.ciiva.com/5557/pyu-rc0402-51-rohs-l-6-r-5557981.pdf?src-supplier=Mouser; ComponentLink6Description: https://datasheet.ciiva.com/5557/pyu-rc0402-51-rohs-l-6-r-5557981.pdf?src-supplier=Mouser; ComponentLink7URL: https://datasheet.ciiva.com/16744/pyu-rc0402-51-rohs-l-6-r-16744286.pdf?src-supplier=Future+Electronics; ComponentLink7Description: https://datasheet.ciiva.com/16744/pyu-rc0402-51-rohs-l-6-r-16744286.pdf?src-supplier=Future+Electronics; ComponentLink8URL: https://datasheet.ciiva.com/16857/pyu-rc0402-51-rohs-l-6-16857071.pdf?src-supplier=Avnet+Europe; ComponentLink8Description: https://datasheet.ciiva.com/16857/pyu-rc0402-51-rohs-l-6-16857071.pdf?src-supplier=Avnet+Europe; Supplier 2: Mouser; Supplier 3: TTI; Supplier Part Number 1: 311-40.2KLRCT-ND; Supplier Part Number 2: 603-RC0402FR-0740K2L; Supplier Part Number 3: RC0402FR-0740K2L
R5 = RC0402FR-0722K1L: RES SMD 22.1K OHM 1% 1/16W 0402; Manufacturer 1: Yageo; Resistance: 22.1kR; Temperature Coefficient: 100ppm/°C; Power Rating: 62.5mW; Max Power Dissipation: 63mW; Voltage Rating (DC): 50V; Supplier 1: Digi-Key; Manufacturer Part Number 1: RC0402FR-0722K1L; RoHS: Yes; Category: Chip SMD Resistors; Stock 1: 22819; Pricing 1: 1=0.10000, 10=0.01600, 100=0.00640, 1000=0.00289, 2500=0.00251, 5000=0.00207 (USD); Case/Package: 0402; Case Code (Metric): 1005; Case Code (Imperial): 0402; Min Operating Temperature: -55°C; Max Operating Temperature: 155°C; Tolerance: 1%; Packaging: Tape and Reel; Composition: Thick Film; Number of Terminations: 2; Package Quantity: 1; Voltage Rating: 50V; Termination: SMD/SMT; Features: Moisture Resistant; Military Standard: Not; Working Voltage: 50V; Length: 1mm; Height: 0.016inch; Width: 0.02inch; Depth: 0.5mm; Lead Free: Lead Free; REACH SVHC: No SVHC; ComponentLink1URL: https://datasheet.ciiva.com/2553/pyu-r-int-thick-7-2553200.pdf?src-supplier=Digi-Key; ComponentLink1Description: https://datasheet.ciiva.com/2553/pyu-r-int-thick-7-2553200.pdf?src-supplier=Digi-Key; ComponentLink2URL: https://datasheet.ciiva.com/2553/pyu-r-int-thick-7-2553201.pdf?src-supplier=Digi-Key; ComponentLink2Description: https://datasheet.ciiva.com/2553/pyu-r-int-thick-7-2553201.pdf?src-supplier=Digi-Key; ComponentLink3URL: https://datasheet.ciiva.com/2553/pyu-r-int-thick-7-2553202.pdf?src-supplier=Digi-Key; ComponentLink3Description: https://datasheet.ciiva.com/2553/pyu-r-int-thick-7-2553202.pdf?src-supplier=Digi-Key; ComponentLink4URL: https://datasheet.ciiva.com/15189/getdatasheetpartid-251817-15189388.pdf?src-supplier=Verical; ComponentLink4Description: https://datasheet.ciiva.com/15189/getdatasheetpartid-251817-15189388.pdf?src-supplier=Verical; ComponentLink5URL: https://datasheet.ciiva.com/7983/1018594-7983501.pdf?src-supplier=Element14; ComponentLink5Description: https://datasheet.ciiva.com/7983/1018594-7983501.pdf?src-supplier=Element14; Supplier 2: Digi-Key; Supplier 3: Future Electronics; Supplier 4: Mouser; Supplier Part Number 1: 311-22.1KLRCT-ND; Supplier Part Number 2: 311-22.1KLRTR-ND; Supplier Part Number 3: RC0402FR-0722K1L-CUTT; Supplier Part Number 4: 603-RC0402FR-0722K1L
TP7 TP8 TP50-TP52 TP55-TP57 = TEST_POINT
U1 = LM2623LD: General Purpose, Gated Oscillator Based, DC/DC Boost Converter, 14-pin LLP; Manufacturer: National Semiconductor; Manufacturer 1: Texas Instruments; PowerWise: N; CompType: MiscPower; PackageTopMarking: NS*UZXYTT*2623AB; PackageVersion: revA, Aug-2000; RoHS: N; ComponentLink2URL: http://www.national.com/pf/LM/LM2623.html; ComponentLink3URL: http://www.national.com/packaging/folders/lda14a.html; ComponentLink1Description: LM2623 Datasheet; PinCount: 14; PackageDescription: LLP, Plastic, Dual, 4 x 4 x 0.75mm Body, 14 Lead, 0.5mm Pitch; RevisionNote: Component URLs added; PackageReference: LDA14A; DatasheetVersion: Dec-2005; ComponentLink3Description: LDA14A Package Page; ComponentLink1URL: http://www.national.com/ds/LM/LM2623.pdf; ComponentLink2Description: LM2623 Web Page; Manufacturer Part Number 1: LM2623LD
U51 = TLV70018DCK: IC REG LINEAR 1.8V 200MA SC70-5 Linear Voltage Regulator IC  1 Output  200mA SC-70-5; Manufacturer 1: Texas Instruments; Manufacturer Part Number 1: TLV70018DCKR; Max Power Dissipation: 320mW; Number of Outputs: 1; Dropout Voltage: 175mV; Max Input Voltage: 5.5V; Min Input Voltage: 2V; Min Current Limit: 220mA; Polarity: Positive; Output Voltage Accuracy: 2%; Quiescent Current: 30uA; Output Type: Fixed; Nominal Supply Current: 31uA; Supplier 1: Digi-Key; Stock 1: 63905; Pricing 1: 1=0.48000, 10=0.40900, 100=0.30570, 500=0.24020, 1000=0.18561 (USD); RoHS: Yes; Case/Package: SC; Number of Pins: 5; Contact Plating: Gold; Min Operating Temperature: -40°C; Max Operating Temperature: 125°C; Packaging: Tape and Reel; Package Quantity: 1; Output Voltage: 1.8V; Output Current: 200mA; Max Output Current: 200mA; Number of Regulators: 1; Power Dissipation: 320mW; Nominal Output Voltage: 1.8V; Accuracy: 2%; Max Output Voltage: 1.8V; Min Output Voltage: 1.8V; REACH SVHC: No SVHC; Lead Free: Lead Free; ComponentLink1URL: https://datasheet.ciiva.com/41462/001014631-da-01-en-ic-reg-ldo-1-8v-0-tlv70018dckr-sot-5-tid-41462480.pdf?src-supplier=Conrad; ComponentLink1Description: https://datasheet.ciiva.com/41462/001014631-da-01-en-ic-reg-ldo-1-8v-0-tlv70018dckr-sot-5-tid-41462480.pdf?src-supplier=Conrad; Supplier 2: Digi-Key; Manufacturer 2: Texas Instruments; Manufacturer Part Number 2: TLV70018DCKT; Stock 2: 13188; Pricing 2: 1=0.55000, 10=0.46700, 100=0.34900 (USD); Power Rating: 320mW; Length: 2.15mm; Height: 1mm; Width: 1.4mm; Radiation Hardening: No; ComponentLink2URL: https://datasheet.ciiva.com/22700/1882059-22700171.pdf?src-supplier=Element14; ComponentLink2Description: https://datasheet.ciiva.com/22700/1882059-22700171.pdf?src-supplier=Element14; ComponentLink3URL: https://datasheet.ciiva.com/14149/tlv700-eng-ds-14149837.pdf?src-supplier=Distrelec; ComponentLink3Description: https://datasheet.ciiva.com/14149/tlv700-eng-ds-14149837.pdf?src-supplier=Distrelec; ComponentLink4URL: https://datasheet.ciiva.com/7992/1882059-7992894.pdf?src-supplier=Element14; ComponentLink4Description: https://datasheet.ciiva.com/7992/1882059-7992894.pdf?src-supplier=Element14; Supplier Part Number 1: 296-32409-1-ND; Supplier Part Number 2: 296-25269-1-ND